# Altium schematic sheet LCD.SchDoc
size A; SheetNumber: 4; SheetTotal: 6
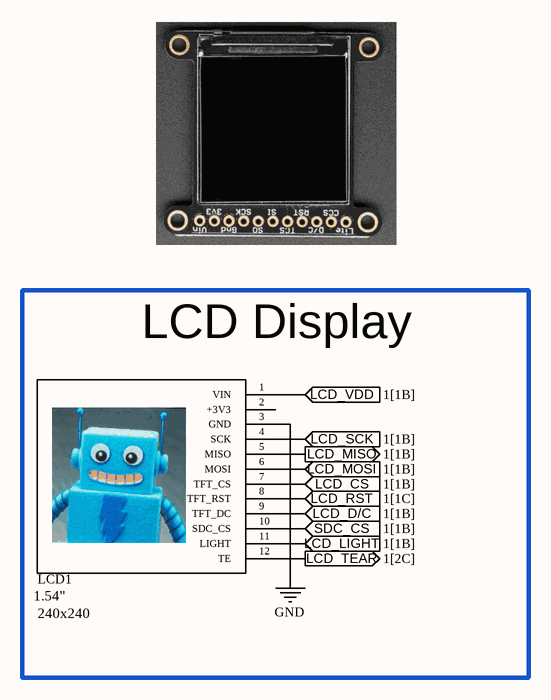
[diagram p0: LCD.SchDoc]

## Parts
LCD1  128x160: 240x240  1.8"TFT: 1.54"  [PCB-PCB-1.7X1.6-INCHES-DISP-LCD_QT154H2201]  (hidden comment: DISP-1.54-INCH-240x240-COLOR-LCD_QT154H2201)

## Blocks framed on the sheet
LCD Display: LCD1

## Ports
LCD_CS (in, see 1[1B]), LCD_D/C (in, see 1[1B]), LCD_LIGHT (in, see 1[1B]), LCD_MISO (out, see 1[1B]), LCD_MOSI (in, see 1[1B]), LCD_RST (in, see 1[1C]), LCD_SCK (in, see 1[1B]), LCD_TEAR (out, see 1[2C]), LCD_VDD (in, see 1[1B]), SDC_CS (in, see 1[1B])

## Nets
GND: LCD1.3(GND)
LCD_CS: LCD1.7(TFT_CS) ; port LCD_CS
LCD_D/C: LCD1.9(TFT_DC) ; port LCD_D/C
LCD_LIGHT: LCD1.11(LIGHT) ; port LCD_LIGHT
LCD_MISO: LCD1.5(MISO) ; port LCD_MISO
LCD_MOSI: LCD1.6(MOSI) ; port LCD_MOSI
LCD_RST: LCD1.8(TFT_RST) ; port LCD_RST
LCD_SCK: LCD1.4(SCK) ; port LCD_SCK
LCD_TEAR: LCD1.12(TE) ; port LCD_TEAR
LCD_VDD: LCD1.1(VIN) ; port LCD_VDD
SDC_CS: LCD1.10(SDC_CS) ; port SDC_CS

Not connected (* = marked no-connect by the designer): LCD1 2(+3V3)

## Library data of the parts
LCD1 = CMP-00049-4: Adafruit 1.54" 240x240 Wide Angle TFT LCD Display with MicroSD - ST7789 with EYESPI Connector; Part Number: 618